# EAGLE design 8ssr (EAGLE 5.05)
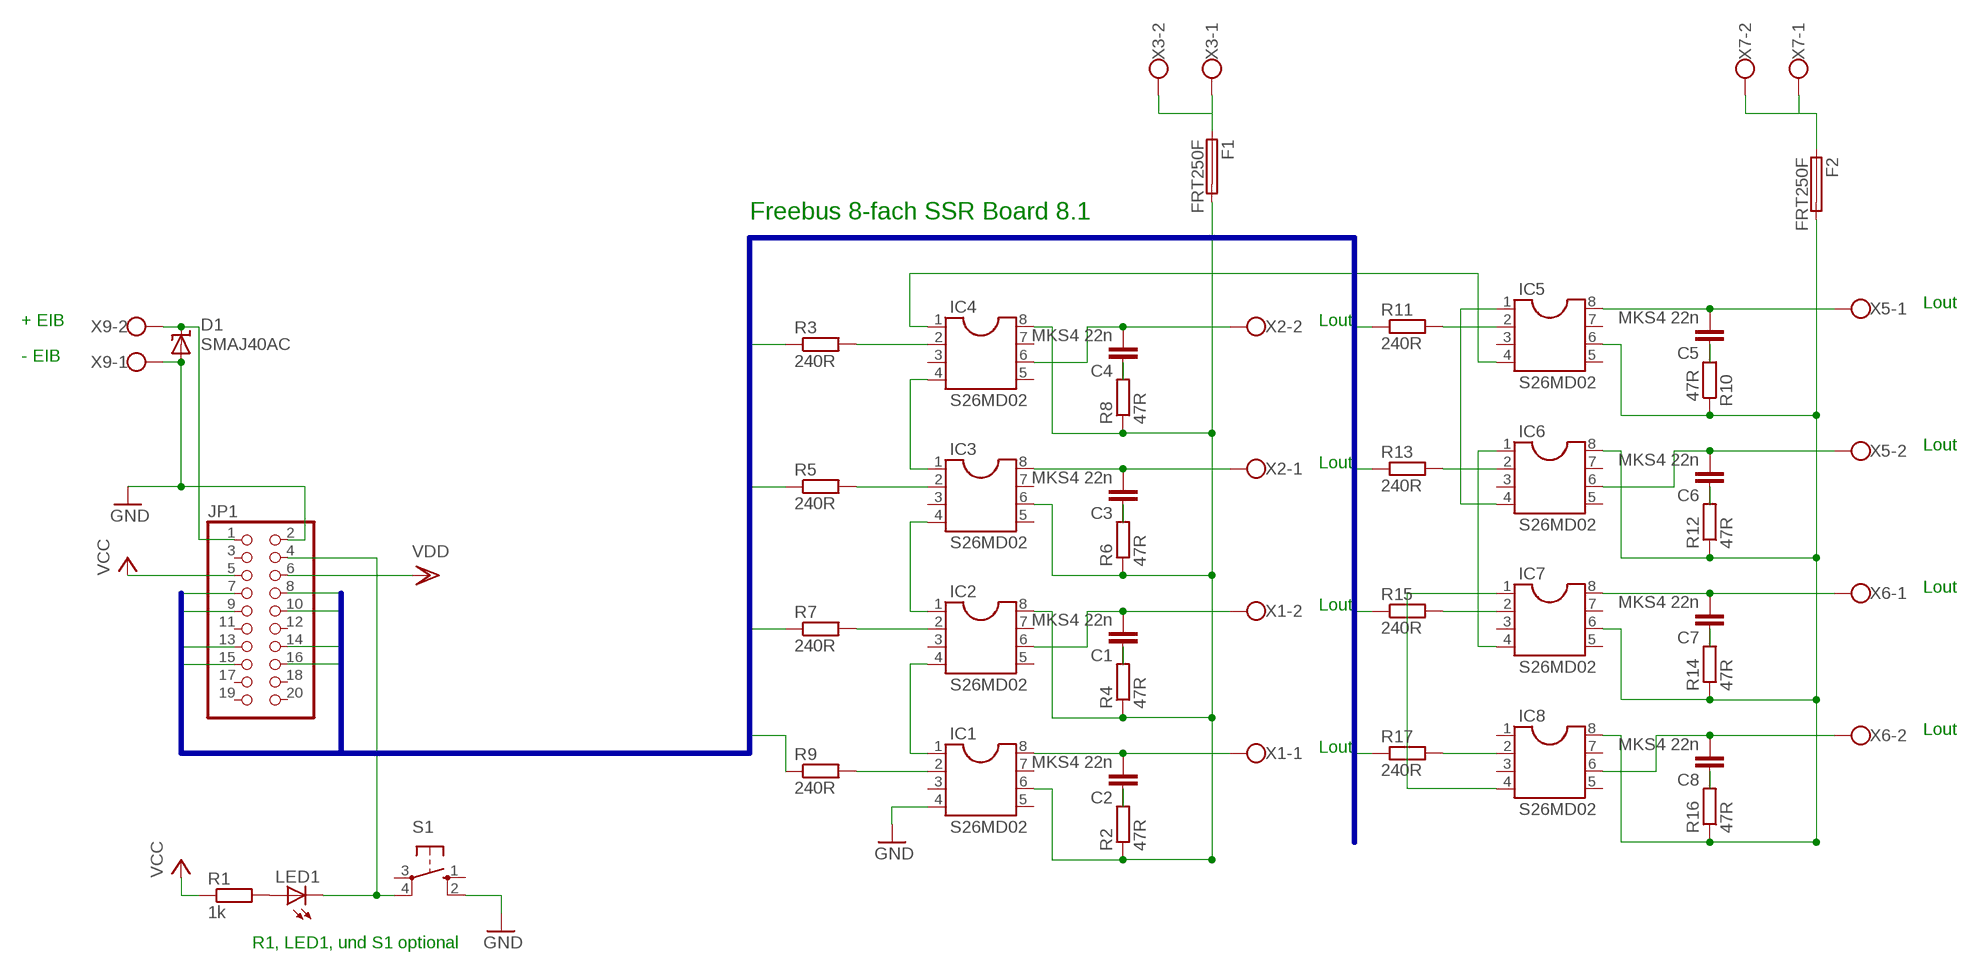
[diagram p0: schematic, sheet 1]

## Parts
C1  MKS4 22n  C7.5/6  [C7.5B6]
C2  MKS4 22n  C7.5/6  [C7.5B6]
C3  MKS4 22n  C7.5/6  [C7.5B6]
C4  MKS4 22n  C7.5/6  [C7.5B6]
C5  MKS4 22n  C7.5/6  [C7.5B6]
C6  MKS4 22n  C7.5/6  [C7.5B6]
C7  MKS4 22n  C7.5/6  [C7.5B6]
C8  MKS4 22n  C7.5/6  [C7.5B6]
D1  SMAJ40AC  SUPPRESSOR-SMBJ  [SMBJ]
F1  FRT250F  [FUSEFRT250F]
F2  FRT250F  [FUSEFRT250F]
IC1  S26MD02  DIL8  [DIL08]
IC2  S26MD02  DIL8  [DIL08]
IC3  S26MD02  DIL8  [DIL08]
IC4  S26MD02  DIL8  [DIL08]
IC5  S26MD02  DIL8  [DIL08]
IC6  S26MD02  DIL8  [DIL08]
IC7  S26MD02  DIL8  [DIL08]
IC8  S26MD02  DIL8  [DIL08]
JP1  PINHD-2X10  [2X10]
LED1  LED3MM  [LED3MM]
R1  1k  R-EU_0207/10  [0207/10]
R2  47R  R-EU_0207/10  [0207/10]
R3  240R  R-EU_0207/5V  [0207/5V]
R4  47R  R-EU_0207/10  [0207/10]
R5  240R  R-EU_0207/5V  [0207/5V]
R6  47R  R-EU_0207/10  [0207/10]
R7  240R  R-EU_0207/5V  [0207/5V]
R8  47R  R-EU_0207/10  [0207/10]
R9  240R  R-EU_0207/5V  [0207/5V]
R10  47R  R-EU_0207/10  [0207/10]
R11  240R  R-EU_0207/5V  [0207/5V]
R12  47R  R-EU_0207/10  [0207/10]
R13  240R  R-EU_0207/5V  [0207/5V]
R14  47R  R-EU_0207/10  [0207/10]
R15  240R  R-EU_0207/5V  [0207/5V]
R16  47R  R-EU_0207/10  [0207/10]
R17  240R  R-EU_0207/5V  [0207/5V]
S1  10-XX  [B3F-10XX]
X1  W237-102  [W237-102]
X2  W237-102  [W237-102]
X3  W237-102  [W237-102]
X5  W237-102  [W237-102]
X6  W237-102  [W237-102]
X7  W237-102  [W237-102]
X9  W237-102  [W237-102]

## Nets
GND: D1.A IC1.4 JP1.2 S1.2(S1) X9.1
IO1: JP1.7 R9.1
IO2: JP1.8 R7.1
IO3: JP1.9 R5.1
IO4: JP1.10 R3.1
IO5: JP1.13 R11.1
IO6: JP1.14 R13.1
IO7: JP1.15 R15.1
IO8: JP1.16 R17.1
L1: F1.P$1 X3.1 X3.2
L1FUSED: F1.P$2 IC1.6 IC2.8 IC3.6 IC4.8 R2.1 R4.1 R6.1 R8.1
L2: F2.P$1 X7.1 X7.2
L2FUSED: F2.P$2 IC5.6 IC6.8 IC7.6 IC8.8 R10.1 R12.1 R14.1 R16.1
N$1: C4.2 IC4.6 X2.2
N$3: C6.2 IC6.6 X5.2
N$4: C8.2 IC8.6 X6.2
N$5: C1.2 IC2.6 X1.2
N$9: C5.2 IC5.8 X5.1
N$11: C7.2 IC7.8 X6.1
N$12: C2.2 IC1.8 X1.1
N$17: C2.1 R2.2
N$18: C3.2 IC3.8 X2.1
N$19: LED1.A R1.2
N$20: D1.C JP1.1 X9.2
N$22: C5.1 R10.2
N$24: C1.1 R4.2
N$28: C3.1 R6.2
N$30: JP1.4 LED1.K(C) S1.4(P1)
N$32: C6.1 R12.2
N$33: C4.1 R8.2
N$38: IC5.2 R11.2
N$39: C7.1 R14.2
N$40: IC6.2 R13.2
N$42: IC8.2 R17.2
N$43: C8.1 R16.2
N$44: IC4.2 R3.2
N$45: IC3.2 R5.2
N$46: IC2.2 R7.2
N$47: IC1.2 R9.2
N$48: IC7.1 IC8.4
N$49: IC1.1 IC2.4
N$50: IC3.1 IC4.4
N$51: IC6.1 IC7.4
N$52: IC5.1 IC6.4
N$53: IC2.1 IC3.4
N$54: IC4.1 IC5.4
N$85: IC7.2 R15.2
VCC: JP1.5 R1.1
VDD: JP1.6
Unconnected: IC1.3 IC1.5 IC1.7 IC2.3 IC2.5 IC2.7 IC3.3 IC3.5 IC3.7 IC4.3 IC4.5 IC4.7 IC5.3 IC5.5 IC5.7 IC6.3 IC6.5 IC6.7 IC7.3 IC7.5 IC7.7 IC8.1 IC8.3 IC8.5 IC8.7 JP1.3 JP1.11 JP1.12 JP1.17 JP1.18 JP1.19 JP1.20 S1.1(S) S1.3(P)

## Buses
IO[1..8]

## Notes on the sheet
- Freebus 8-fach SSR Board 8.1
- Lout
- + EIB | Lout
- - EIB
- Lout
- Lout
- Lout
- Lout
- Lout
- Lout
- R1, LED1, und S1 optional

## Library data of the parts
C1-C8 = capacitor-wima:C: CAPACITOR naming: grid - package width
D1 = diode:SUPPRESSOR-: Suppressor diode
F1 F2 = maje:FRT250F
IC1-IC8 = ic-package:DIL8: Dual In Line / Socket
JP1 = pinhead:PINHD-2X10: PIN HEADER
LED1 = led:LED: LED OSRAM: - CHIPLED LG R971, LG N971, LY N971, LG Q971, LY Q971, LO R971, LY R971 LH N974, LH R974 LS Q976, LO Q976, LY Q976 LO Q996 - Hyper CHIPLED LW Q18S LB Q993, LB Q99A, LB R99A - SideLED LS A670, LO A670, LY A670, LG A670, LP A670 LB A673, LV A673, LT A673, LW A673 LH A674 LY A675 LS A676, LA A676, LO A676, LY A676, LW A676 LS A679, LY A679, LG A679 - Hyper Micro SIDELED® LS Y876, LA Y876, LO Y876, LY Y876 LT Y87S - SmartLED LW L88C, LW L88S LB L89C, LB L89S, LG L890 LS L89K, LO L89K, LY L89K LS L896, LA L896, LO L896, LY L896 - TOPLED LS T670, LO T670, LY T670, LG T670, LP T670 LSG T670, LSP T670, LSY T670, LOP T670, LYG T670 LG T671, LOG T671, LSG T671 LB T673, LV T673, LT T673, LW T673 LH T674 LS T676, LA T676, LO T676, LY T676, LB T676, LH T676, LSB T676, LW T676 LB T67C, LV T67C, LT T67C, LS T67K, LO T67K, LY T67K, LW E67C LS E67B, LA E67B, LO E67B, LY E67B, LB E67C, LV E67C, LT E67C LW T67C LS T679, LY T679, LG T679 LS T770, LO T770, LY T770, LG T770, LP T770 LB T773, LV T773, LT T773, LW T773 LH T774 LS E675, LA E675, LY E675, LS T675 LS T776, LA T776, LO T776, LY T776, LB T776 LHGB T686 LT T68C, LB T68C - Hyper Mini TOPLED® LB M676 - Mini TOPLED Santana® LG M470 LS M47K, LO M47K, LY M47K Source: http://www.osram.convergy.de - LUMILED® LXK2-PW12-R00, LXK2-PW12-S00, LXK2-PW14-U00, LXK2-PW14-V00 LXK2-PM12-R00, LXK2-PM12-S00, LXK2-PM14-U00 LXK2-PE12-Q00, LXK2-PE12-R00, LXK2-PE12-S00, LXK2-PE14-T00, LXK2-PE14-U00 LXK2-PB12-K00, LXK2-PB12-L00, LXK2-PB12-M00, LXK2-PB14-N00, LXK2-PB14-P00, LXK2-PB14-Q00 LXK2-PR12-L00, LXK2-PR12-M00, LXK2-PR14-Q00, LXK2-PR14-R00 LXK2-PD12-Q00, LXK2-PD12-R00, LXK2-PD12-S00 LXK2-PH12-R00, LXK2-PH12-S00 LXK2-PL12-P00, LXK2-PL12-Q00, LXK2-PL12-R00 Source: www.luxeon.com
R1-R17 = rcl:R-EU_: RESISTOR, European symbol
S1 = switch-omron:10-XX: OMRON SWITCH
X1-X3 X5-X7 X9 = con-wago-500:W237-102: WAGO SCREW CLAMP

## Board
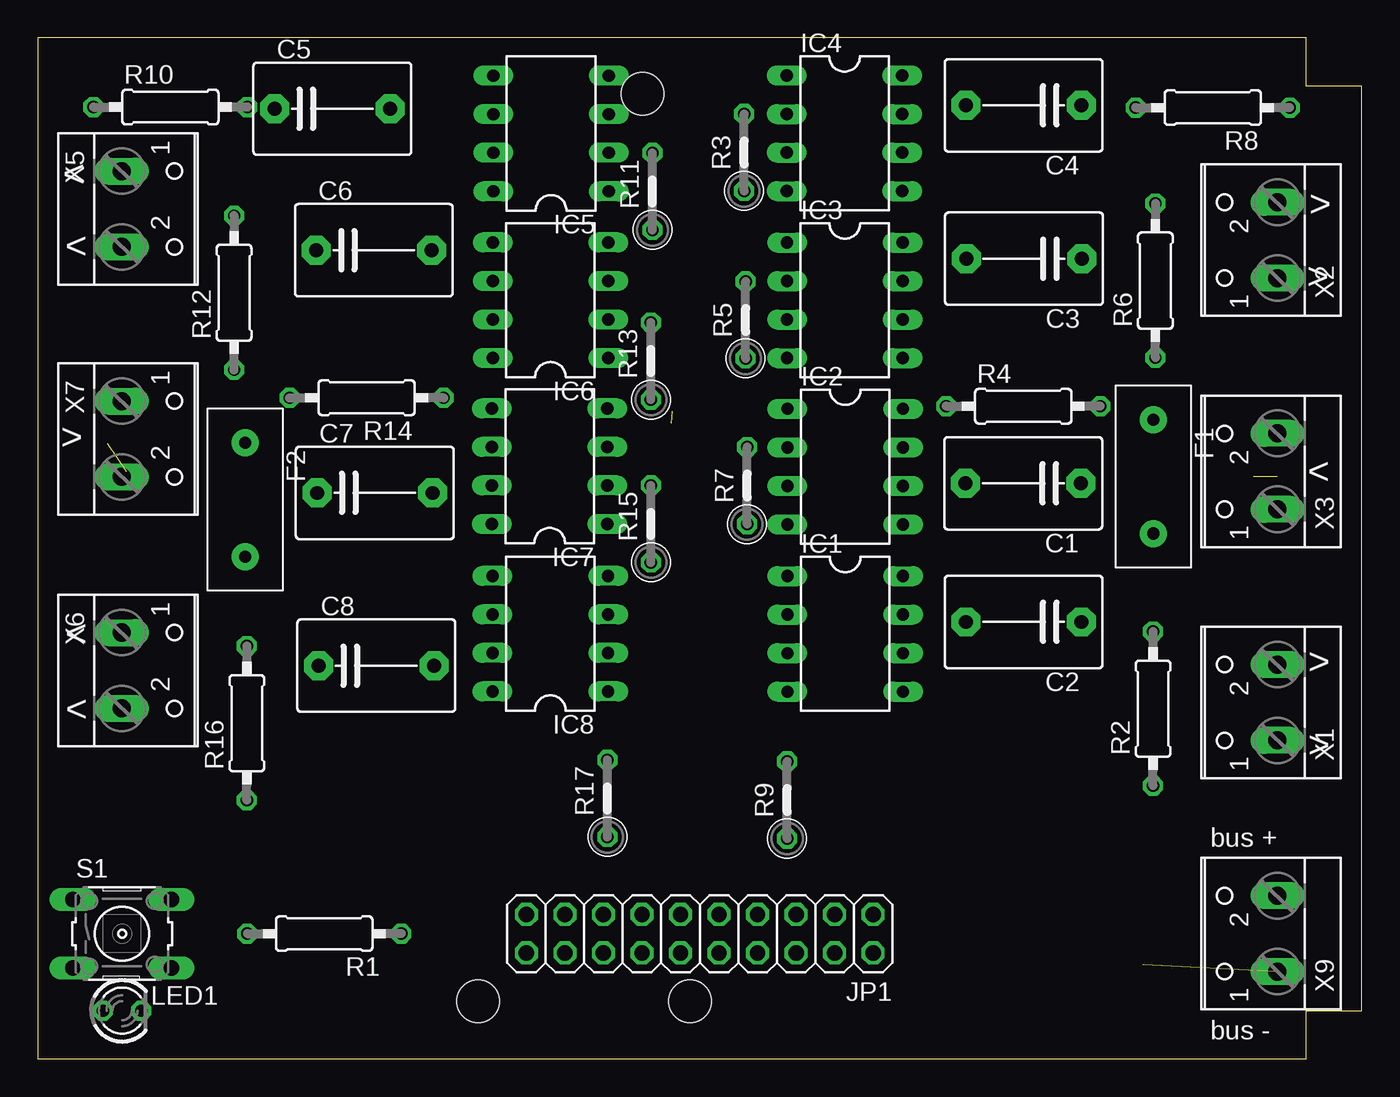
[diagram p1: board, top side]
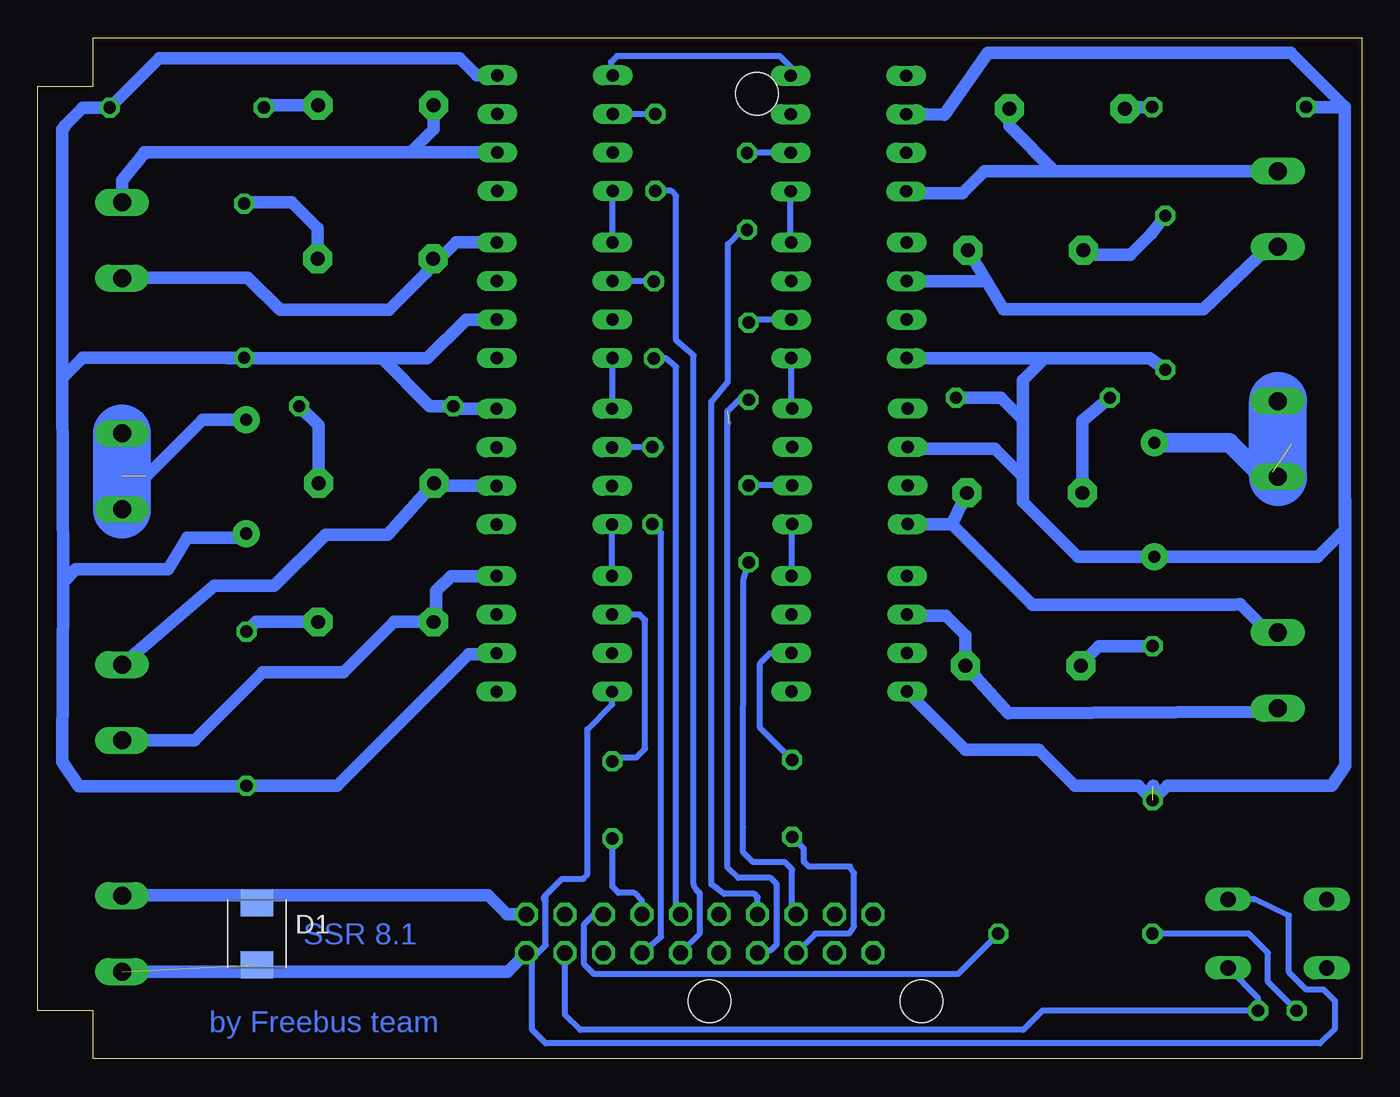
[diagram p2: board, bottom side, seen from below]

Size 87.3 x 67.31 mm. Coordinates in mm from the lower left corner, seen from the top.
Outline: 0,0.01 83.66,0 83.66,3.18 87.3,3.18 87.3,64.13 83.66,64.13 83.66,67.31 0,67.31 0,0.01
Copper layers (1*16): Top 0.035mm / dielectric 1.5mm / Bottom 0.035mm
Design rules "default *": minimum track width 10mil, minimum drill 24mil, track to track 61mil, track to pad 61mil, pad to pad 16mil, via to via 16mil, smd to smd 8mil, copper to edge 10mil, drill to drill 10mil, minimum pad ring 10mil, minimum via ring 8mil, stop-mask expansion 4mil, vias tented up to drill 0mil, thermal gap 10mil
Holes 2.8 mm at 43.02,3.81 39.89,63.63 29.04,3.81

### Footprints (pad centres in the part's own frame; a part is rotated, then mirrored left to right if it is on the bottom)
C7.5B6 = drill 0.914 pad 1.905 octagon: 1 -3.81,0; 2 3.81,0
SMBJ = smd 1.78 x 2.16: A 2.04,0; C -2.03,0
FUSEFRT250F = drill 0.8 pad 1.778 round: P$1 -3.88,-0.12; P$2 3.62,-0.12
DIL08 = drill 0.813 long: 1 -3.81,-3.81; 2 -1.27,-3.81; 3 1.27,-3.81; 4 3.81,-3.81; 5 3.81,3.81; 6 1.27,3.81; 7 -1.27,3.81; 8 -3.81,3.81
2X10 = drill 1.016 octagon: 1 -11.43,-1.27; 2 -11.43,1.27; 3 -8.89,-1.27; 4 -8.89,1.27; 5 -6.35,-1.27; 6 -6.35,1.27; 7 -3.81,-1.27; 8 -3.81,1.27; 9 -1.27,-1.27; 10 -1.27,1.27; 11 1.27,-1.27; 12 1.27,1.27; 13 3.81,-1.27; 14 3.81,1.27; 15 6.35,-1.27; 16 6.35,1.27; 17 8.89,-1.27; 18 8.89,1.27; 19 11.43,-1.27; 20 11.43,1.27
LED3MM = drill 0.813 octagon: A -1.27,0; K 1.27,0
0207/10 = drill 0.813 octagon: 1 -5.08,0; 2 5.08,0
0207/5V = drill 0.813 octagon: 1 -2.54,0; 2 2.54,0
B3F-10XX = drill 1.016 long: 1 -3.251,2.261; 2 3.251,2.261; 3 -3.251,-2.261; 4 3.251,-2.261
W237-102 = drill 1.194 long: 1 -2.5,-1.27; 2 2.5,-1.27

### Placement (x,y rotation side)
C1  64.99,37.95 180 top
C2  65.01,28.8 180 top
C3  65.04,52.76 180 top
C4  65.01,62.86 180 top
C5  19.42,62.64 0 top
C6  22.16,53.31 0 top
C7  22.22,37.31 0 top
C8  22.32,25.93 0 top
D1  72.86,8.26 270 bottom
F1  73.69,38.25 270 top
F2  13.79,36.74 270 top
IC1  53.24,28.02 270 top
IC2  53.24,39.05 270 top
IC3  53.22,50.01 270 top
IC4  53.2,61.02 270 top
IC5  33.84,61.01 90 top
IC6  33.8,50.01 90 top
IC7  33.75,39.07 90 top
IC8  33.79,28.03 90 top
JP1  43.65,8.26 180 top
LED1  5.55,3.17 0 top
R1  18.88,8.26 180 top
R2  73.55,23.09 90 top
R3  46.58,59.76 90 top
R4  64.99,43.03 0 top
R5  46.67,48.72 90 top
R6  73.7,51.31 90 top
R7  46.78,37.8 90 top
R8  77.48,62.71 180 top
R9  49.42,17.07 90 top
R10  8.73,62.75 0 top
R11  40.53,57.19 90 top
R12  12.94,50.51 90 top
R13  40.42,46 90 top
R14  21.68,43.59 180 top
R15  40.43,35.27 90 top
R16  13.78,22.13 90 top
R17  37.55,17.17 90 top
S1  5.55,8.26 0 top
X1  80.48,23.5 90 top
X2  80.48,53.98 90 top
X3  80.48,38.73 90 top
X5  6.79,56.03 270 top
X6  6.79,25.61 270 top
X7  6.79,40.87 270 top
X9  80.48,8.26 90 top

### Tracks (layer width: path | path; a pad name or v marks a point on that pad's centre or on a via)
GND  (1 unrouted)
  Bottom 0.406: 54.7,6.6 54.7,1.91 53.81,1.02 2.76,1.02 1.74,2.03 1.74,3.81 2.5,4.57 3.64,4.57 4.79,5.71 4.79,9.45 7.05,10.52 S1.2 | 54.7,6.6 JP1.2 | 53.81,10.39 53.81,7.49 54.7,6.6 | 53.81,10.39 53.81,10.67 | IC1.4 49.43,23.38 51.07,21.74 51.07,12.14 51.35,11.86 52.74,11.86 53.91,10.69 53.91,10.49 53.81,10.39
  Bottom 0.813: X9.1 56.31,5.75 JP1.2
IO1
  Bottom 0.406: R9.1 49.42,11.35 49.01,10.95 47.97,10.95 47.46,10.44 JP1.7
IO2
  Bottom 0.406: JP1.8 46.19,8.05 46.19,34.67 R7.1
IO3
  Bottom 0.406: R5.1 45.86,46.18 45.2,45.62 45.2,9.91 JP1.9
IO4
  Bottom 0.406: 43.83,11.1 43.65,10.92 43.65,8.26 JP1.10 | 43.83,11.1 43.86,11.13 | R3.1 45.52,57.22 45.2,56.9 45.2,47.37 44.06,46.38 44.06,11.48 43.83,11.1
IO5
  Bottom 0.406: R11.1 40.87,54.65 41.8,53.72 41.8,44.63 42.89,43.33 42.89,11.51 42.05,10.87 40.04,10.87 39.84,10.67 JP1.13
IO6  (1 unrouted)
  Bottom 0.406: R13.1 41.06,43.46 41.82,42.7 41.82,12.65 41.11,11.94 39,11.94 38.57,11.51 38.57,7.54 38.95,7.16 39.66,7.16 JP1.14 | 41.77,41.91 41.8,41.88
IO7
  Bottom 0.406: 37.32,9.55 JP1.15 37.55,9.78 37.55,12.5 38.04,12.98 40.14,12.98 40.79,13.62 40.79,15.27 40.78,31.24 40.78,31.6 R15.1
IO8
  Bottom 0.406: JP1.16 36.03,8.26 33.8,8.26 33.46,8.74 33.46,12.24 33.74,12.67 36.46,12.67 36.79,13 36.79,13.87 R17.1
L1  (1 unrouted)
  Bottom 0.813: F1.P$1 76.45,42.13 80.16,38.42
  Bottom 1.27: X3.2 80.85,42.13
  Bottom 3.81: X3.1 X3.2
L1FUSED
  Bottom 0.813: 85.64,31.43 85.64,31.29 85.69,19.58 84.62,17.98 73.77,17.98 R2.1 67.55,18.01 58.89,26.67 56.98,26.67 | 85.64,31.43 85.69,44.88 | 85.69,44.88 85.69,61.29 85.53,61.44 85.53,61.52 84.34,62.71 R8.1 79.31,65.96 59.5,65.96 58.37,64.83 IC4.8 | F1.P$2 73.86,34.34 77.46,34.34 78.71,32.3 83.82,32.27 84.8,32.27 85.64,31.43 | 74.84,46.23 84.34,46.23 85.69,44.88 | 74.84,46.23 R6.1 | 64.61,46.18 74.79,46.18 74.84,46.23 | 64.61,46.18 61.63,46.18 59.07,48.74 IC3.6 | IC2.8 59.73,42.86 R4.1 61.45,43.03 64.61,46.18 | 56.35,26.67 56.98,26.67 | 56.98,26.67 IC1.6
L2  (1 unrouted)
  Bottom 1.27: 4.69,40.62 4.61,40.54 | F2.P$1 8.73,40.62 6.82,38.71 5.87,38.71 X7.2
  Bottom 3.81: X7.2 X7.1
L2FUSED  (1 unrouted)
  Bottom 0.813: 1.1,48.56 1.1,47.8 | 1.1,48.95 1.1,48.56 | 1.1,48.95 1.1,62.71 | 1.1,62.71 1.1,62.76 4.66,66.32 24.65,66.32 27.52,62.25 28.69,62.28 IC5.6 | 1.1,48.56 1.1,48.51 | 1.1,36.85 1.1,35.25 | 1.1,36.85 1.1,48.95 | 1.1,36.85 1.08,36.83 1.08,34.92 | R10.1 1.14,62.75 1.1,62.71 | 1.08,34.92 1.08,19.33 1.97,18.01 12.82,18.01 R16.1 14.74,18.01 18.91,18.01 21.27,20.37 26.13,20.37 IC8.8 | 22.34,38.23 22.34,36.73 18.73,33.12 F2.P$2 2.89,33.12 1.08,34.92 | 22.34,38.23 22.34,41.71 | 22.34,41.71 22.34,42.14 23.79,43.59 R14.1 26.68,43.51 | 13.73,18.01 13.78,17.96 | R12.1 13.97,46.2 20.89,46.2 | 20.89,46.2 IC6.8 | 22.34,41.71 22.34,44.75 20.89,46.2 | IC7.6 29.83,40.23 24.19,40.23 22.34,38.38 22.34,38.23
N$1
  Bottom 0.813: 57.94,59.75 IC4.6 57.76,59.77 62.73,59.77 | X2.2 81.75,57.91 80.28,59.71 80.28,59.77 62.73,59.77 | C4.2 61.2,61.29 62.73,59.77
N$3
  Bottom 0.813: X5.2 6.12,53.53 10.45,49.43 23.63,49.43 24.71,51.22 | 24.71,51.22 C6.2 | IC6.6 24.77,51.28 24.71,51.22
N$4
  Bottom 0.813: X6.2 6.62,23.11 6.62,22.89 23.31,22.78 C8.2 26.13,27.92 27.42,29.21 29.89,29.21 IC8.6
N$5
  Bottom 0.813: X1.2 75.68,31.19 71.72,31.19 68.34,34.57 64.22,34.57 C1.2 60.6,37.78 IC2.6
N$9
  Bottom 0.813: X5.1 20.26,58.53 | 20.26,58.53 24.87,58.53 26.33,57.07 29.91,57.07 IC5.8 | C5.2 23.23,61.5 20.26,58.53
N$11
  Bottom 0.813: X6.1 6.12,28.11 7.99,29.97 8.09,29.97 8.47,29.95 21.7,29.95 27.02,35.26 | 29.9,35.31 IC7.8 27.02,35.26 | C7.2 27.02,35.26
N$12
  Bottom 0.813: X1.1 76.96,21 72.48,25.48 67.14,25.48 63.82,28.8 C2.2 61.02,28.98 61.02,30.86 60.06,31.83 IC1.8
N$17
  Bottom 0.813: C2.1 72.91,28.8 R2.2
N$18
  Bottom 0.813: IC3.8 59.73,53.82 61.23,52.32 C3.2 61.66,51.87 64.15,49.38 71.34,49.38 73.47,51.51 81.71,51.51 X2.1
N$19
  Bottom 0.406: LED1.A 6.18,5.08 6.18,6.98 7.46,8.26 R1.2
N$20
  Bottom 0.254: X9.2 81.75,10.79
  Bottom 0.406: 72.86,10.79 D1.C
  Bottom 0.61: 80.44,10.75 80.48,10.75 80.48,10.79
  Bottom 0.813: 80.48,10.75 X9.2 | JP1.1 56.35,9.53 57.62,10.79 72.86,10.79 80.48,10.79
N$22
  Bottom 0.813: R10.2 15.55,62.75 C5.1
N$24
  Bottom 0.813: R4.2 68.8,41.76 C1.1
N$28
  Bottom 0.813: C3.1 68.85,54.76 70.57,56.49 73.6,56.49 R6.2
N$30
  Bottom 0.406: JP1.4 52.54,2.92 51.52,1.91 22.31,1.91 21.04,3.17 LED1.K 6.82,4.01 S1.4
N$32
  Bottom 0.813: R12.2 13.85,54.41 15.25,53.01 18.04,53.01 C6.1
N$33
  Bottom 0.813: C4.1 72.25,62.86 R8.2
N$38
  Bottom 0.406: IC5.2 40.93,59.74 R11.2
N$39
  Bottom 0.813: R14.2 18.41,42.05 C7.1
N$40
  Bottom 0.406: IC6.2 40.7,48.74 R13.2
N$42
  Bottom 0.406: IC8.2 38.99,26.76 39.66,26.09 39.66,21.82 R17.2
N$43
  Bottom 0.813: R16.2 15.34,27.2 17.34,27.2 18.51,26.03 C8.1
N$44
  Bottom 0.406: IC4.2 46.18,62.29 R3.2
N$45
  Bottom 0.406: IC3.2 46.16,51.28 R5.2
N$46
  Bottom 0.406: IC2.2 46.19,40.32 R7.2
N$47
  Bottom 0.406: IC1.2 47.61,29.29 47.26,28.93 47.26,20.45 47.84,19.86 49.16,19.86 R9.2 49.29,19.61 49.29,19.46
N$48
  Bottom 0.406: IC7.1 37.56,31.89 IC8.4
N$49
  Bottom 0.406: IC1.1 IC2.4
N$50
  Bottom 0.406: IC4.4 49.39,53.84 IC3.1
N$51
  Bottom 0.406: IC6.1 37.61,42.93 IC7.4
N$52
  Bottom 0.406: IC5.1 37.65,53.86 IC6.4
N$53
  Bottom 0.406: IC3.4 49.41,42.88 IC2.1
N$54
  Bottom 0.406: IC5.4 37.65,65.4 38.37,66.12 49.11,66.12 49.52,65.71 49.52,64.96 IC4.1
N$85
  Bottom 0.406: R15.2 IC7.2
VCC
  Bottom 0.406: R1.1 26.63,5.59 50.63,5.59 51.27,6.22 51.27,8.89 50.63,9.53 JP1.5

### Text on the board
Bottom: SSR 8.1 | by Freebus team
tPlace: > | < | > | < | < | > | > | < | > | < | bus + | bus -